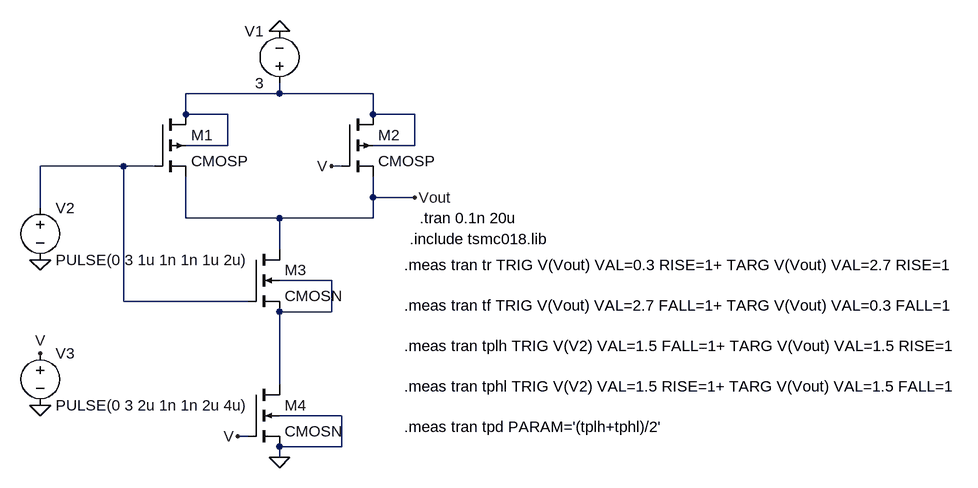
[diagram p0: schematic q3.asc]
q3.asc, the LTspice schematic file:
Version 4
SHEET 1 1528 720
WIRE 480 144 480 128
WIRE 480 144 336 144
WIRE 624 144 480 144
WIRE 336 176 336 144
WIRE 400 176 336 176
WIRE 624 176 624 144
WIRE 688 176 624 176
WIRE 400 224 400 176
WIRE 400 224 336 224
WIRE 688 224 688 176
WIRE 688 224 624 224
WIRE 240 256 112 256
WIRE 288 256 240 256
WIRE 576 256 560 256
WIRE 624 304 624 272
WIRE 688 304 624 304
WIRE 112 320 112 256
WIRE 336 336 336 272
WIRE 480 336 336 336
WIRE 624 336 624 304
WIRE 624 336 480 336
WIRE 480 384 480 336
WIRE 560 432 480 432
WIRE 240 464 240 256
WIRE 432 464 240 464
WIRE 560 480 560 432
WIRE 560 480 480 480
WIRE 480 592 480 480
WIRE 576 640 480 640
WIRE 432 672 416 672
WIRE 576 688 576 640
WIRE 576 688 480 688
WIRE 480 704 480 688
FLAG 480 704 0
FLAG 480 48 0
FLAG 112 400 0
FLAG 112 624 0
FLAG 112 544 V
FLAG 560 256 V
FLAG 416 672 V
FLAG 688 304 Vout
SYMBOL pmos4 288 176 R0
SYMATTR InstName M1
SYMATTR Value CMOSP
SYMBOL pmos4 576 176 R0
SYMATTR InstName M2
SYMATTR Value CMOSP
SYMBOL nmos4 432 384 R0
SYMATTR InstName M3
SYMATTR Value CMOSN
SYMBOL nmos4 432 592 R0
SYMATTR InstName M4
SYMATTR Value CMOSN
SYMBOL voltage 480 144 R180
WINDOW 0 24 96 Left 2
WINDOW 3 24 16 Left 2
SYMATTR InstName V1
SYMATTR Value 3
SYMBOL voltage 112 304 R0
SYMATTR InstName V2
SYMATTR Value PULSE(0 3 1u 1n 1n 1u 2u)
SYMBOL voltage 112 528 R0
SYMATTR InstName V3
SYMATTR Value PULSE(0 3 2u 1n 1n 2u 4u)
TEXT 696 336 Left 2 !.tran 0.1n 20u
TEXT 672 408 Left 2 !.meas tran tr TRIG V(Vout) VAL=0.3 RISE=1+ TARG V(Vout) VAL=2.7 RISE=1\n \n.meas tran tf TRIG V(Vout) VAL=2.7 FALL=1+ TARG V(Vout) VAL=0.3 FALL=1\n \n.meas tran tplh TRIG V(V2) VAL=1.5 FALL=1+ TARG V(Vout) VAL=1.5 RISE=1\n \n.meas tran tphl TRIG V(V2) VAL=1.5 RISE=1+ TARG V(Vout) VAL=1.5 FALL=1\n \n.meas tran tpd PARAM='(tplh+tphl)/2'
TEXT 680 368 Left 2 !.include tsmc018.lib

The netlist it stands for:
* q3.asc
M1 N001 N002 Vout N001 CMOSP
M2 N001 V Vout N001 CMOSP
M3 Vout N002 N003 N003 CMOSN
M4 N003 V 0 0 CMOSN
V1 N001 0 3
V2 N002 0 PULSE(0 3 1u 1n 1n 1u 2u)
V3 V 0 PULSE(0 3 2u 1n 1n 2u 4u)
.model NMOS NMOS
.model PMOS PMOS
.lib standard.mos
.tran 0.1n 20u
.meas tran tr TRIG V(Vout) VAL=0.3 RISE=1+ TARG V(Vout) VAL=2.7 RISE=1
.meas tran tf TRIG V(Vout) VAL=2.7 FALL=1+ TARG V(Vout) VAL=0.3 FALL=1
.meas tran tplh TRIG V(V2) VAL=1.5 FALL=1+ TARG V(Vout) VAL=1.5 RISE=1
.meas tran tphl TRIG V(V2) VAL=1.5 RISE=1+ TARG V(Vout) VAL=1.5 FALL=1
.meas tran tpd PARAM='(tplh+tphl)/2'
.include tsmc018.lib
.backanno
.end